# EAGLE schematic OBDShield (EAGLE 8.3.1)
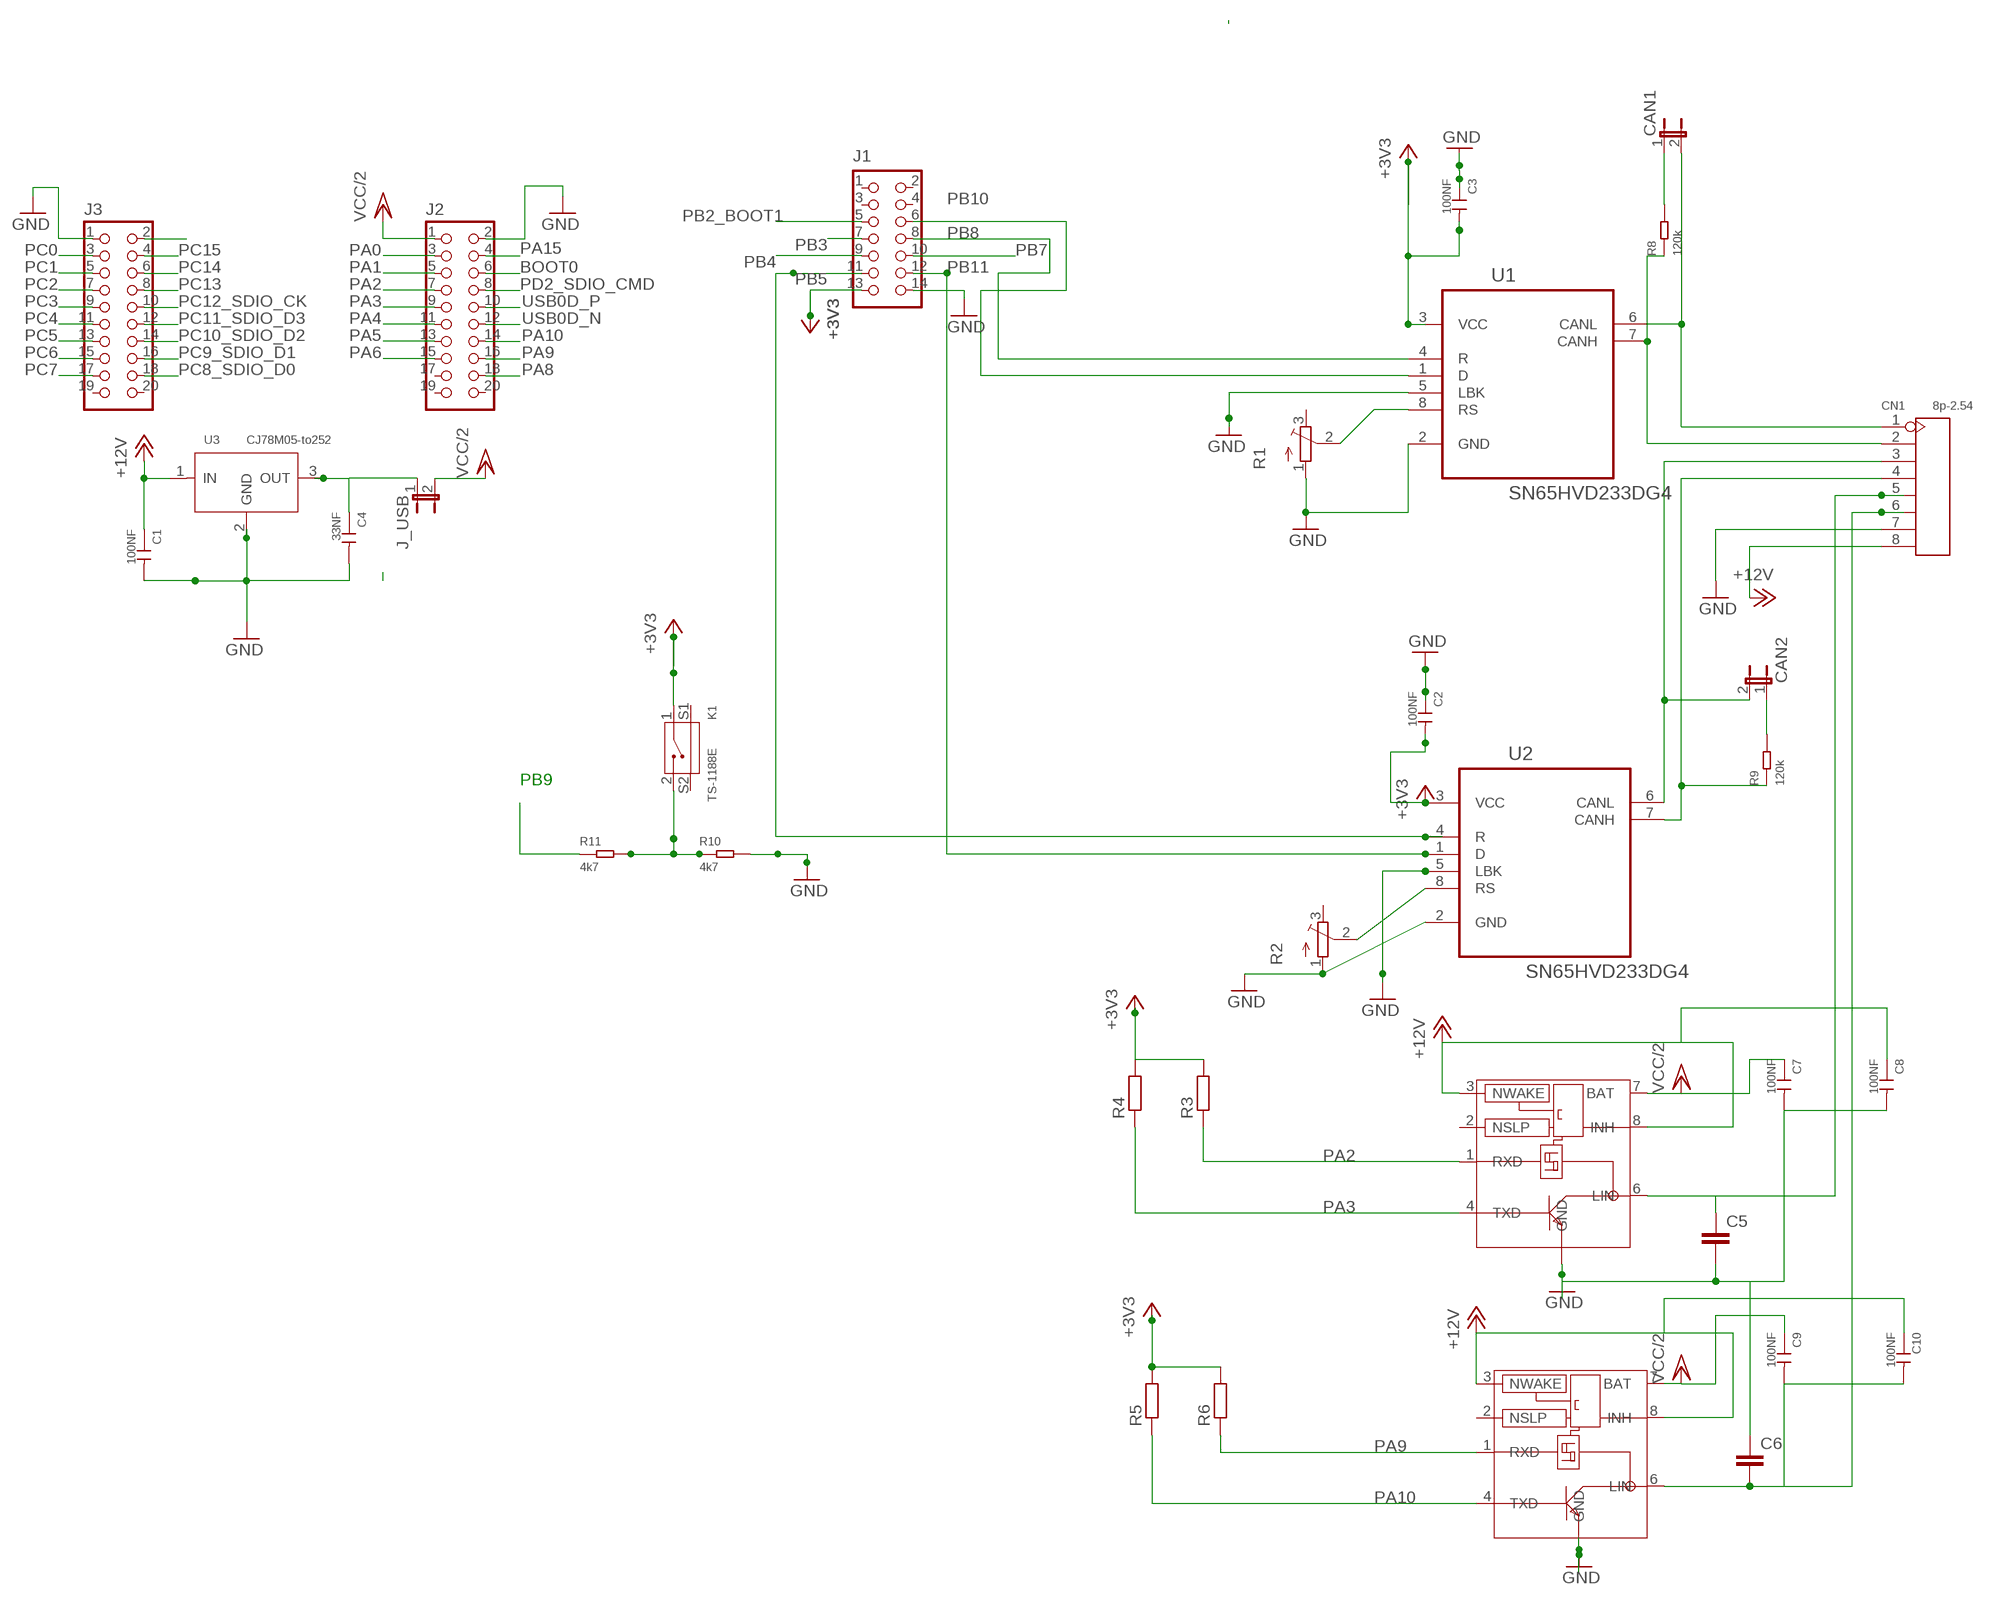
[diagram p0: schematic, sheet 1]

## Parts
C1  100NF  CERAMIC-100NF-50V-20%-Y5V(0805)  [C0805]
C2  100NF  CERAMIC-100NF-50V-20%-Y5V(0805)  [C0805]
C3  100NF  CERAMIC-100NF-50V-20%-Y5V(0805)  [C0805]
C4  33NF  CERAMIC-100NF-50V-20%-Y5V(0805)  [C0805]
C5  CAP1206  [1206]
C6  CAP1206  [1206]
C7  100NF  CERAMIC-100NF-50V-20%-Y5V(0805)  [C0805]
C8  100NF  CERAMIC-100NF-50V-20%-Y5V(0805)  [C0805]
C9  100NF  CERAMIC-100NF-50V-20%-Y5V(0805)  [C0805]
C10  100NF  CERAMIC-100NF-50V-20%-Y5V(0805)  [C0805]
CAN1  JP1E  [JP1]
CAN2  JP1E  [JP1]
CN1  8p-2.54  DIP-BLACK-FEMALE-HEADER-VERT(8P-2.54)  [H8-2.54]
J1  HYDRABUS_SHIELD_CON_HEADER_2X07  [HYDRABUS_SHIELD_M2X7]
J2  HYDRABUS_SHIELD_CON_HEADER_2X10  [HYDRABUS_SHIELD_M2X10]
J3  HYDRABUS_SHIELD_CON_HEADER_2X10  [HYDRABUS_SHIELD_M2X10]
J_USB  JP1E  [JP1]
K1  TS-1188E  SMD-BUTTON-2+2P  [SW4-SMD-7.0X3.5X3.5MM-90D]
R1  TRIM_EU-SM-42/43A  [SM-42/43A]
R2  TRIM_EU-SM-42/43A  [SM-42/43A]
R3  R-EU_M1206  [M1206]
R4  R-EU_M1206  [M1206]
R5  R-EU_M1206  [M1206]
R6  R-EU_M1206  [M1206]
R8  120k  SMD-RES-33K-1%-1/4W(1206)  [R1206]
R9  120k  SMD-RES-33K-1%-1/4W(1206)  [R1206]
R10  4k7  SMD-RES-33K-1%-1/4W(1206)  [R1206]
R11  4k7  SMD-RES-33K-1%-1/4W(1206)  [R1206]
U1  SN65HVD233DG4  [SOIC127P600X175-8N]
U2  SN65HVD233DG4  [SOIC127P600X175-8N]
U3  CJ78M05-to252  PMIC-CJ78M05(TO-252)  [TO-252]
U$1  TJA1020SO8  [SO8]
U$2  TJA1020SO8  [SO8]

## Nets
+3V3 [VDD]: C2.2 C3.2 J1.13 K1.1 R3.2 R4.2 R5.2 R6.2 U1.3(VCC) U2.3(VCC)
+12V [VDD]: C1.1 C8.1 C10.1 CN1.8 U3.1(IN) U$1.3(NWAKE) U$1.8(INH) U$2.3(NWAKE) U$2.8(INH)
BOOT0: J2.6
GND [VDD]: C1.2 C2.1 C3.1 C4.2 C5.2 C6.1 C7.2 C8.2 CN1.7 J1.14 J2.2 J3.1 R1.1(A) R2.1(A) R10.2 U1.2(GND) U1.5(LBK) U2.2(GND) U2.5(LBK) U3.2(GND) U$1.5(GND) U$2.5(GND)
N$1: R1.2(S) U1.8(RS)
N$4: C5.1 CN1.5 U$1.6(LIN)
N$7: C6.2 C9.2 C10.2 CN1.6 U$2.6(LIN)
N$9 [CAN]: CAN1.2 CN1.1 U1.6(CANL)
N$10 [CAN]: CN1.2 R8.1 U1.7(CANH)
N$11 [CAN]: CAN2.2 CN1.3 U2.6(CANL)
N$12 [CAN]: CN1.4 R9.1 U2.7(CANH)
N$15 [VDD]: C4.1 J_USB.1 U3.3(OUT)
N$16: CAN2.1 R9.2
N$17: R2.2(S) U2.8(RS)
N$19: CAN1.1 R8.2
N$21: K1.2 R10.1 R11.2
N$22 [POWER]: J3.2
PA0: J2.3
PA1: J2.5
PA2: J2.7 R3.1 U$1.1(RXD)
PA3: J2.9 R4.1 U$1.4(TXD)
PA4: J2.11
PA5: J2.13
PA6: J2.15
PA8: J2.18
PA9: J2.16 R6.1 U$2.1(RXD)
PA10: J2.14 R5.1 U$2.4(TXD)
PA15: J2.4
PB2_BOOT1: J1.5
PB3: J1.7
PB4: J1.9
PB5: J1.11 U2.4(R)
PB7: J1.10 R11.1
PB8: J1.8 U1.4(R)
PB10: J1.6 U1.1(D)
PB11: J1.12 U2.1(D)
PC0: J3.3
PC1: J3.5
PC2: J3.7
PC3: J3.9
PC4: J3.11
PC5: J3.13
PC6: J3.15
PC7: J3.17
PC8_SDIO_D0: J3.18
PC9_SDIO_D1: J3.16
PC10_SDIO_D2: J3.14
PC11_SDIO_D3: J3.12
PC12_SDIO_CK: J3.10
PC13: J3.8
PC14: J3.6
PC15: J3.4
PD2_SDIO_CMD: J2.8
USB0D_N: J2.12
USB0D_P: J2.10
VCC/2 [VDD]: C7.1 C9.1 J2.1 J_USB.2 U$1.7(BAT) U$2.7(BAT)
Unconnected: J1.1 J1.2 J1.3 J1.4 J2.17 J2.19 J2.20 J3.19 J3.20 K1.S1 K1.S2 R1.3(E) R2.3(E) U$1.2(NSLP) U$2.2(NSLP)

## Notes on the sheet
- PB9

## Library data of the parts
C1-C3 C7-C10 = Seeed-OPL-Capacitor:CERAMIC-100NF-50V-20%-Y5V(0805): 302010145
C4 = Seeed-OPL-Capacitor:CERAMIC-100NF-50V-20%-Y5V(0805): 302010145; VALUE: 100NF
C5 C6 = _c2h:CAP: Capacitor Standard 0603 ceramic capacitor, and 0.1" leaded capacitor.
CAN1 CAN2 J_USB = jumper:JP1E: JUMPER
CN1 = Seeed-OPL-Connector:DIP-BLACK-FEMALE-HEADER-VERT(8P-2.54): 320030061; MPN: F185-1108A1BSYC1
J1 = hydrabus_shield:HYDRABUS_SHIELD_CON_HEADER_2X07: 2x7 Pin header
J2 J3 = hydrabus_shield:HYDRABUS_SHIELD_CON_HEADER_2X10: 2x10 Pin header
K1 = Seeed-OPL-Button:SMD-BUTTON-2+2P: 311020023; MPN: TS-1188E
R1 R2 = pot:TRIM_EU-: POTENTIOMETER
R3-R6 = resistor:R-EU_: RESISTOR, European symbol
R8-R11 = Seeed-OPL-Resistor:SMD-RES-33K-1%-1/4W(1206): 301010725; MPN: RC1206FR-0733KL; VALUE: 33k
U1 U2 = Texas Instruments_By_element14_Batch_1:SN65HVD233DG4: CAN TRANSCEIVERS; MPN: SN65HVD233DG4; OC_FARNELL: 1207268; OC_NEWARK: 16M2304; PACKAGE: SOIC-8; SUPPLIER: TI
U3 = Seeed-OPL-ic:PMIC-CJ78M05(TO-252): 310030100; MPN: CJ78M05
U$1 U$2 = nxp:TJA1020: Lin Transiver Vbat 5...27Volt 3,3Volt support no extra supply needed ->www.lin-subbus.org ->www.semiconductor.philips.com/pip/tja1020t

## Net classes
0 default: width 0.254 mm, drill 0.5 mm, clearance 0.203 mm
1 POWER: width 0.254 mm, drill 0.5 mm, clearance 0.203 mm
2 VDD: width 0.33 mm, drill 0.5 mm, clearance 0.203 mm
3 CAN: width 0.33 mm, drill 0.5 mm, clearance 0.305 mm